# EAGLE design 240_ammeter (EAGLE 9.6.2)
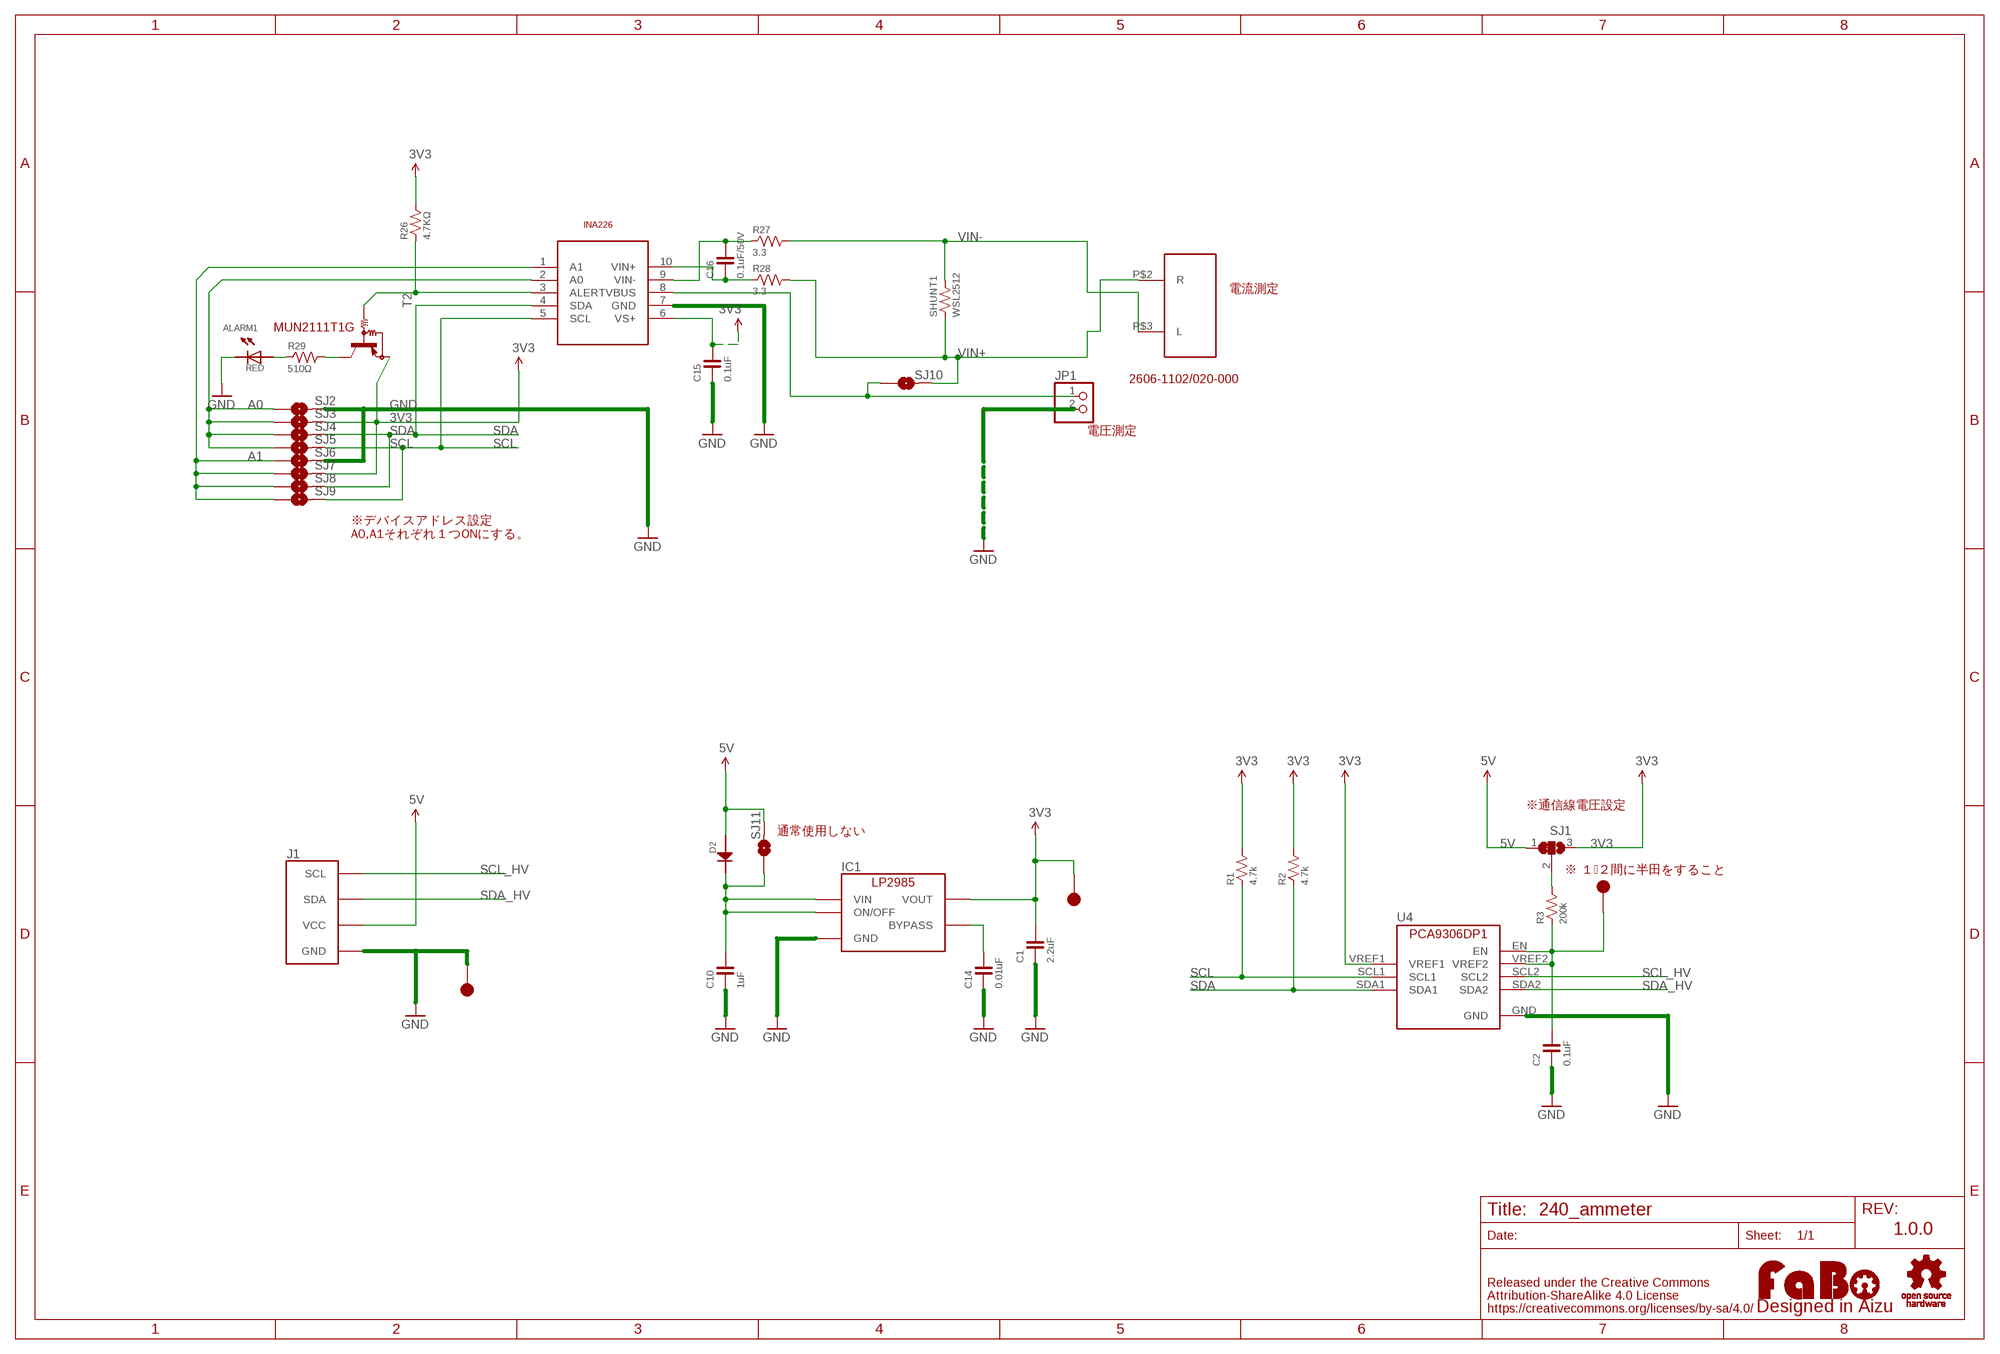
[diagram p0: schematic, sheet 1]

## Parts
ALARM1  RED  LED-0603  [0603]
C1  2.2uF  CAPACITOR-0603  [0603]
C2  0.1uF  CAPACITOR-0603  [0603]
C10  1uF  CAPACITOR-0603  [0603]
C14  0.01uF  CAPACITOR-0603  [0603]
C15  0.1uF  CAPACITOR-0603  [0603]
C16  0.1uF/50V  CAPACITOR-0603  [0603]
D2  1N4148  [1N4148W]
IC1  LP2985-33  LP2985-33DBV  [SOT-23-5]
J1  FABO_BRICK_I2C-S04B-PASK-2  [FABO_BRICK_I2C_S04B-PASK-2]
JP1  PINHD-1X2  [1X02]
LOGO1  LOGO_FABO-M  [LOGO_FABO_M]
R1  4.7k  RESISTOR-0603  [0603]
R2  4.7k  RESISTOR-0603  [0603]
R3  200k  RESISTOR-0603  [0603]
R26  4.7KΩ  RESISTOR-0603  [0603]
R27  3.3  RESISTOR-0603  [0603]
R28  3.3  RESISTOR-0603  [0603]
R29  510Ω  RESISTOR-0603  [0603]
SHUNT1  WSL2512  [2512INCH]
SJ1  SJ2W  [SJ_2]
SJ2  FABO-SMD-JUMPER-SELECT  [SMD-JUMPER_SELECT]
SJ3  FABO-SMD-JUMPER-SELECT  [SMD-JUMPER_SELECT]
SJ4  FABO-SMD-JUMPER-SELECT  [SMD-JUMPER_SELECT]
SJ5  FABO-SMD-JUMPER-SELECT  [SMD-JUMPER_SELECT]
SJ6  FABO-SMD-JUMPER-SELECT  [SMD-JUMPER_SELECT]
SJ7  FABO-SMD-JUMPER-SELECT  [SMD-JUMPER_SELECT]
SJ8  FABO-SMD-JUMPER-SELECT  [SMD-JUMPER_SELECT]
SJ9  FABO-SMD-JUMPER-SELECT  [SMD-JUMPER_SELECT]
SJ10  FABO-SMD-JUMPER-SELECT  [SMD-JUMPER_SELECT]
SJ11  FABO-SMD-JUMPER-SELECT  [SMD-JUMPER_SELECT]
T2  MUN2111T1-PNP_DRIVER-SC59-BEC  [SC59-BEC]
TP1  TP-15  [TP-15]
TP2  TP-15  [TP-15]
TP5  TP-15  [TP-15]
U3  TI-INA226  [TI-INA226]
U4  PCA9306DP1  [TSSOP8]
U$1  LOGO_OSHW-M_BOTTOM  [LOGO_OSHW_M_BOTTOM]
U$5  2606-1102/020-000  [2606-1102/020-000]

## Nets
3V3: C1.2 C15.2 IC1.5(VOUT) R1.2 R2.2 R26.2 SJ1.3 SJ3.2 SJ7.2 T2.E TP5.1 U3.6(VS+) U4.VREF1
5V: D2.ANODE J1.VCC SJ1.1 SJ11.2
A0: SJ2.1 SJ3.1 SJ4.1 SJ5.1 U3.2(A0)
A1: SJ6.1 SJ7.1 SJ8.1 SJ9.1 U3.1(A1)
GND: ALARM1.CATHODE C1.1 C2.1 C10.1 C14.1 C15.1 IC1.2(GND) J1.GND JP1.2 SJ2.2 SJ6.2 TP1.1 U3.7(GND) U4.GND
N$8: C2.2 R3.1 TP2.1 U4.EN U4.VREF2
N$9: R3.2 SJ1.2
N$11: C10.2 D2.CATHODE IC1.1(VIN) IC1.3(ON/OFF) SJ11.1
N$25: C16.2 R27.1 U3.9(VIN-)
N$26: C16.1 R28.1 U3.10(VIN+)
N$27: R26.1 T2.B U3.3(ALERT)
N$28: ALARM1.ANODE R29.1
N$29: R29.2 T2.C
N$30: C14.2 IC1.4(BYPASS)
N$32: JP1.1 SJ10.1 U3.8(VBUS)
SCL: R1.1 SJ5.2 SJ9.2 U3.5(SCL) U4.SCL1
SCL_HV: J1.SCL U4.SCL2
SDA: R2.1 SJ4.2 SJ8.2 U3.4(SDA) U4.SDA1
SDA_HV: J1.SDA U4.SDA2
VIN+: R28.2 SHUNT1.P$1 SJ10.2 U$5.P$2(R)
VIN-: R27.2 SHUNT1.P$2 U$5.P$3(L)

## Notes on the sheet
- 電流測定
- MUN2111T1G
- 2606-1102/020-000
- 電圧測定
- ※デバイスアドレス設定
  A0,A1それぞれ１つONにする。
- ※通信線電圧設定
- 通常使用しない
- ※ １−２間に半田をすること
- 1.0.0

## Library data of the parts
ALARM1 = FaBo-LED:LED
C1 C2 C10 C14-C16 = FaBo-Capacitor:CAPACITOR: CAPACITOR
D2 = FaBo-Diode:1N4148
IC1 = FaBo-Supply:LP2985: LP2985
J1 = FaBo-Template:FABO_BRICK_I2C: FaBo Brick I2C
JP1 = pinhead:PINHD-1X2: PIN HEADER
LOGO1 = component:LOGO_FABO
R1-R3 R26-R29 = FaBo-Resistors:RESISTOR: RESISTOR
SHUNT1 = FaBo-Resistors:WSL2512
SJ1 = jumper:SJ2W: SMD solder JUMPER
SJ2-SJ11 = FaBo-PIN:FABO-SMD-JUMPER-SELECT
T2 = transistor:*-PNP_DRIVER-: PNP Bias Resistor Transistor
TP1 TP2 TP5 = FaBo-Supply:TP
U3 = FaBo-Sensor:TI-INA226
U4 = FaBo-LevelTranslator:PCA9306DP1
U$1 = component:LOGO_OSHW
U$5 = FaBo-Terminal:2606-1102/020-000

## Board
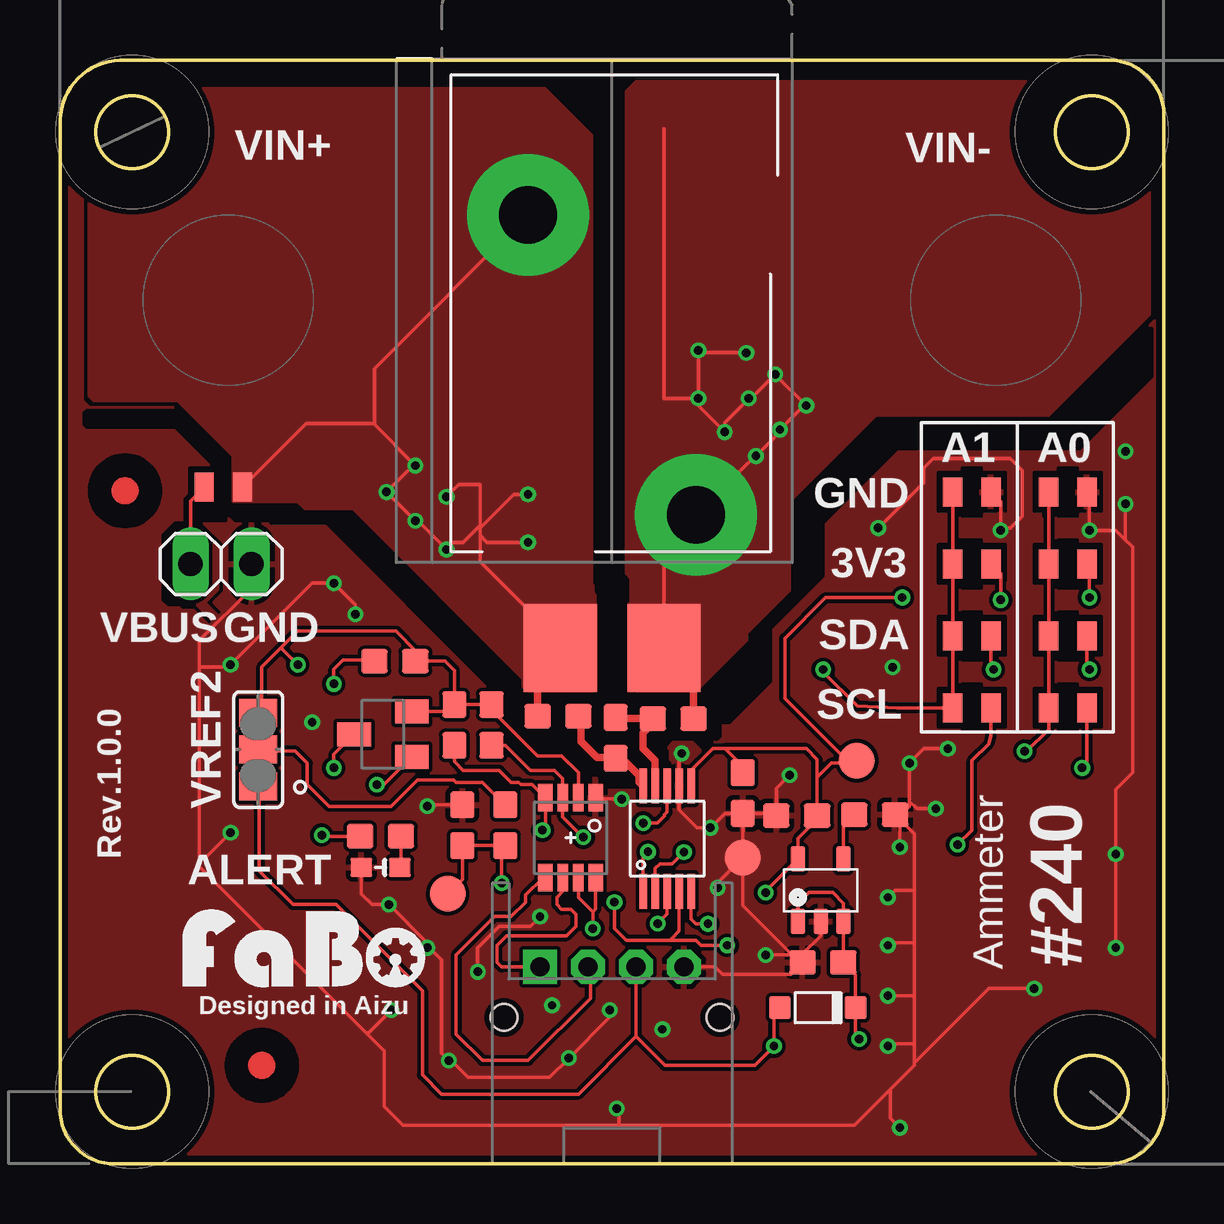
[diagram p1: board, top side]
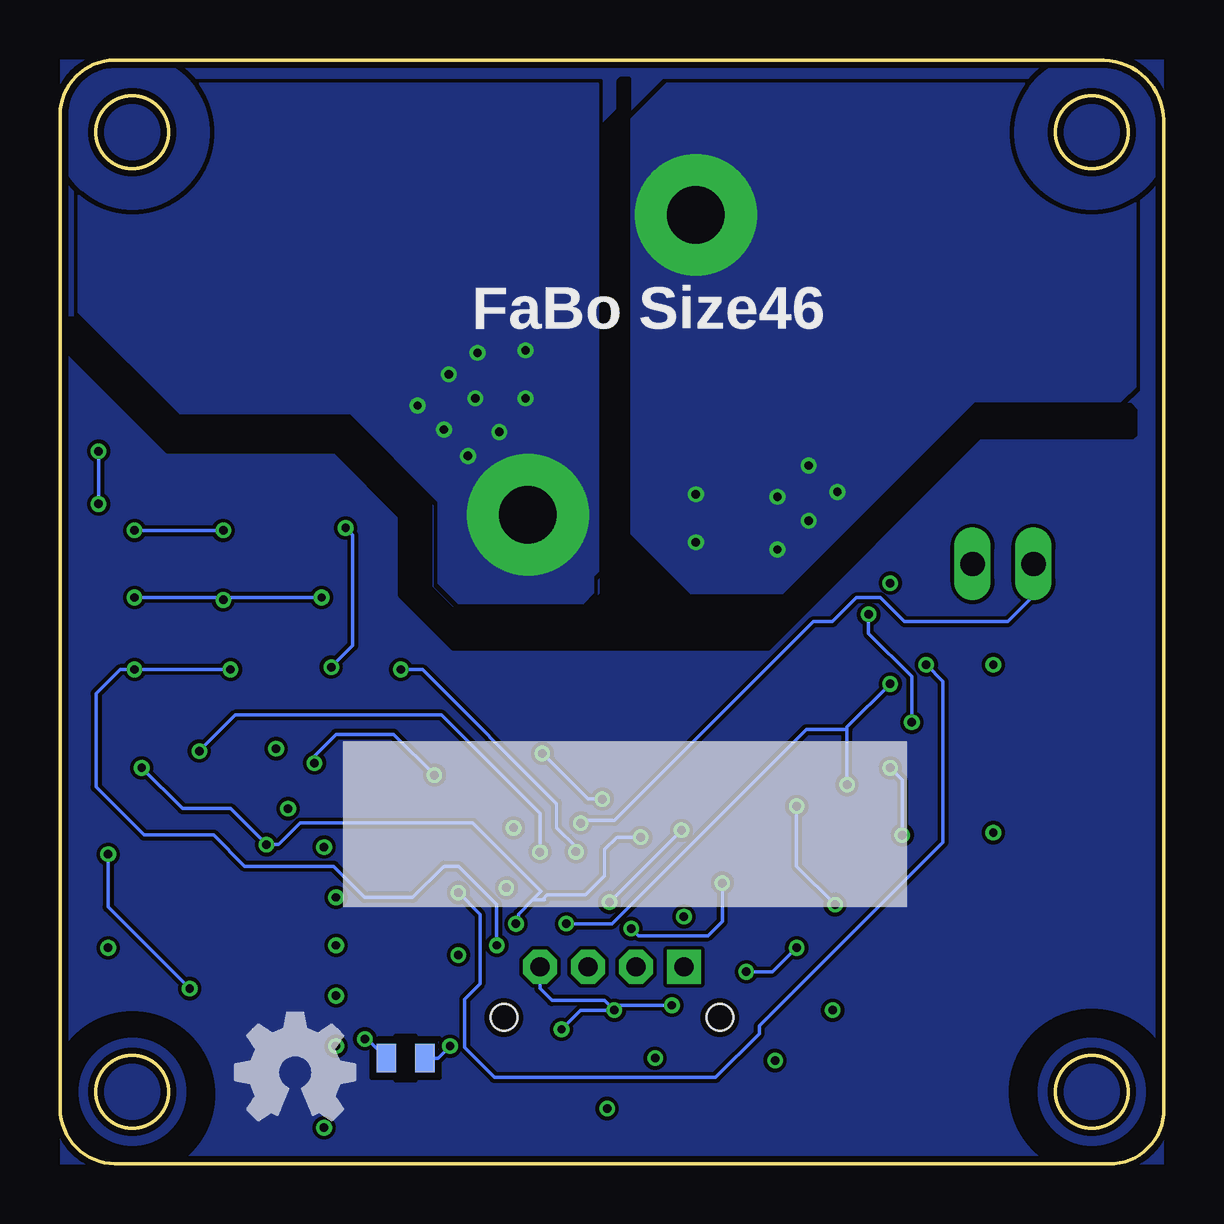
[diagram p2: board, bottom side, seen from below]

Size 46.02 x 46.02 mm. Coordinates in mm from the lower left corner, seen from the top.
Outline: 0.01,2.51 0.01,43.51 arc-87 2.51,46.01 43.51,46.01 arc-100 46.01,43.51 46.01,2.51 arc-99 43.51,0.01 2.51,0.01 arc-102 0.01,2.51
Outline: circle at 3.01,3.01 radius 1.5
Outline: circle at 43.01,3.01 radius 1.5
Outline: circle at 43.01,43.01 radius 1.5
Outline: circle at 3.01,43.01 radius 1.5
Copper layers (1*16): Top 0.035mm / dielectric 1.6mm / Bottom 0.035mm
Design rules "PCBway": minimum track width 6mil, minimum drill 12mil, track to track 6mil, track to pad 6mil, pad to pad 6mil, via to via 6mil, smd to smd 6mil, copper to edge 10mil, drill to drill 10mil, minimum pad ring 10mil, minimum via ring 6mil, stop-mask expansion 2mil, vias tented up to drill 100mil, thermal gap 8mil
tRestrict: area 1,19.8 to 19,31.4; area 5.7,26.8 to 6.9,27.4; area 27.2,18.4 to 45.5,34.8; area 22.3,19.4 to 23.5,45.4; area -0.3,39.7 to 6.4,46.4; area 39.7,39.7 to 46.4,46.4; area -0.3,-0.3 to 6.4,6.4; area 39.7,-0.3 to 46.4,6.4; area 37.7,27.1 to 38.3,28.9; area 41.7,27.1 to 42.3,28.9; area 37.7,24.1 to 38.3,25.9; area 41.7,24.1 to 42.3,25.9; 4 more areas; 199 lines
bRestrict: area 1.2,21.5 to 45.9,45.2; area -0.3,39.7 to 6.4,46.4; area 39.7,39.7 to 46.4,46.4; area 39.7,-0.4 to 46.4,6.3; area -0.3,-0.3 to 6.4,6.4; area 0.2,0.2 to 5.8,5.8; area 40.2,0.2 to 45.8,5.8; area 31.3,3.6 to 31.9,5.2; 12 lines

### Footprints (pad centres in the part's own frame; a part is rotated, then mirrored left to right if it is on the bottom)
0603 = smd 0.9 x 0.8: ANODE -0.8,0; CATHODE 0.8,0
0603' = smd 1.1 x 1: 1 -0.85,0; 2 0.85,0
1N4148W = smd 0.9 x 0.95: ANODE 0,0; CATHODE 3.15,0
SOT-23-5 = smd 0.6 x 1.05: 1 -0.95,-1.3; 2 0,-1.3; 3 0.95,-1.3; 4 0.95,1.3; 5 -0.95,1.3
FABO_BRICK_I2C_S04B-PASK-2 = drill 0.8 pad 1.422 octagon: GND -3,0; SDA 1,0; VCC -1,0 | drill 0.8 pad 1.422 square: SCL 3,0 | hole 1.1: 4.5,2.1; -4.5,2.1
1X02 = drill 1.016 long: 1 -1.27,0; 2 1.27,0
2512INCH = smd 3.05 x 3.68: P$1 -2.16,0; P$2 2.16,0
SJ_2 = smd 1.168 x 1.6: 1 -1.524,0; 2 0,0; 3 1.524,0
SMD-JUMPER_SELECT = smd 0.8 x 1.2: 1 -0.8,0; 2 0.8,0
SC59-BEC = smd 1 x 1.4: B -0.95,-1.2; C 0,1.2; E 0.95,-1.2
TP-15 = smd 1.5 x 1.5: 1 0,0
TI-INA226 = smd 1.45 x 0.3: 1 -2.2,1; 2 -2.2,0.5; 3 -2.2,0; 4 -2.2,-0.5; 5 -2.2,-1; 6 2.2,-1; 7 2.2,-0.5; 8 2.2,0; 9 2.2,0.5; 10 2.2,1
TSSOP8 = smd 0.6 x 1.15: EN -1.05,1.663; GND -1.05,-1.663; SDA1 1.05,-1.663; SDA2 1.05,1.663 | smd 0.45 x 1.15: SCL1 0.325,-1.663; SCL2 0.325,1.663; VREF1 -0.325,-1.663; VREF2 -0.325,1.663
2606-1102/020-000 = drill 2.4 pad 5.08: P$2 3.5,-6.25; P$3 -3.5,6.25

### Placement (x,y rotation side)
ALARM1  13.36,12.36 180 top
C1  2.2uF  [0603']  30.71,14.52 0 top
C2  0.1uF  [0603']  16.77,14.12 270 top
C10  1uF  [0603']  31.8,8.4 0 top
C14  0.01uF  [0603']  33.96,14.56 180 top
C15  0.1uF  [0603']  28.46,15.46 90 top
C16  0.1uF/50V  [0603']  23.16,17.76 90 top
D2  30.01,6.51 0 top
IC1  31.71,11.41 0 top
J1  23.01,8.21 180 top
JP1  6.71,25.01 0 top
LOGO1  10.17,7 0 top
R1  4.7k  [0603']  17.99,18.3 90 top
R2  4.7k  [0603']  16.44,18.3 90 top
R3  200k  [0603']  18.56,14.12 90 top
R26  4.7KΩ  [0603']  13.96,20.96 0 top
R27  3.3  [0603']  25.56,18.56 0 top
R28  3.3  [0603']  20.76,18.66 180 top
R29  510Ω  [0603']  13.36,13.66 180 top
SHUNT1  23.01,21.51 0 top
SJ1  8.26,17.27 90 top
SJ2  42.01,28.01 0 top
SJ3  42.01,25.01 0 top
SJ4  42.01,22.01 0 top
SJ5  42.01,19.01 0 top
SJ6  38.01,28.01 0 top
SJ7  38.01,25.01 0 top
SJ8  38.01,22.01 0 top
SJ9  38.01,19.01 0 top
SJ10  6.81,28.21 0 top
SJ11  31.61,4.41 0 bottom
T2  13.46,17.91 90 top
TP1  28.46,12.76 0 top
TP2  16.16,11.26 0 top
TP5  33.21,16.81 0 top
U3  25.31,13.56 90 top
U4  21.28,13.6 180 top
U$1  36.21,3.82 0 top
U$3  [MARK_POINT_3MM]  8.41,4.11 0 top
U$4  [MARK_POINT_3MM]  2.71,28.06 0 top
U$5  23.01,33.31 180 top

### Tracks (layer width: path | path; a pad name or v marks a point on that pad's centre or on a via)
3V3  (via drill 0.35)
  Top 0.152: U3.6 26.31,16.41 27.21,17.31 27.71,17.31 | C15.2 28.46,16.56 27.71,17.31 | 31.56,16.11 C1.2 31.56,14.36 30.76,13.56 IC1.5 | 31.56,16.11 31.56,16.86 31.11,17.31 27.71,17.31 | IC1.5 30.76,13.06 | R2.2 R1.2 17.99,18.93 19.91,17.01 20.91,17.01 21.61,16.32 U4.VREF1 | R2.2 16.44,20.58 16.06,20.96 R26.2 14.81,21.41 14.01,22.21 9.91,22.21 9.26,21.56 | T2.E 16.15,18.86 R2.2 | SJ1.3 8.41,18.95 8.41,20.71 9.26,21.56 | 31.56,16.11 32.16,16.71 33.11,16.71 TP5.1 32.81,16.81 30.21,19.41 30.21,21.91 31.91,23.61 v35.11,23.61 | IC1.5 29.41,11.36 v29.41,11.31 | v9.91,20.81 9.26,21.46 9.26,21.56 | v39.21,23.51 39.21,24.61 SJ7.2 | SJ3.2 42.91,24.91 v42.91,23.61
  Bottom 0.152: v29.41,11.31 28.51,10.41 28.51,7.51 29.15,6.87 29.15,4.85 27.91,3.61 18.69,3.61 16.87,5.43 16.87,5.75 9.21,13.41 9.21,20.11 v9.91,20.81 | v35.11,23.61 39.11,23.61 v39.21,23.51 39.31,23.61 v42.91,23.61
5V  (via drill 0.35)
  Top 0.152: J1.VCC 24.01,5.31 | 24.01,5.31 25.21,4.11 28.96,4.11 v29.76,4.91 29.76,6.26 D2.ANODE | SJ1.1 8.31,15.7 8.31,12.21 9.71,10.81 11.51,10.81 15.11,7.21 15.11,3.71 15.91,2.91 21.61,2.91 24.01,5.31
  Bottom 0.152: SJ11.2 30.26,4.41 v29.76,4.91
A0  (via drill 0.35)
  Top 0.152: 24.81,11.8 U3.2 24.81,12.31 25.01,12.51 25.52,12.51 v26.01,13 | 41.26,27.61 SJ2.1 SJ3.1 SJ4.1 | 41.26,21.86 SJ4.1 | SJ4.1 SJ5.1 41.21,18.11 40.31,17.21 v40.21,17.21
  Bottom 0.152: v26.01,13 26.01,14.61 30.11,18.71 38.71,18.71 v40.21,17.21
A1  (via drill 0.35)
  Top 0.152: U3.1 24.31,12.81 v24.51,13.01 | v31.81,20.61 31.81,20.51 33.24,19.08 34.91,19.01 SJ9.1 SJ8.1 SJ7.1 SJ6.1
  Bottom 0.152: v24.51,13.01 24.51,13.21 25.31,14.01 25.31,15.01 30.91,20.61 v31.81,20.61
GND  (via drill 0.35)
  Top 0.152: IC1.2 31.71,9.51 30.95,8.75 C10.1 | C10.1 30.89,8.34 | 28.61,14.61 C15.1 27.71,14.61 v27.11,14.01 26.56,14.01 25.81,14.76 U3.7 25.81,17.01 v25.91,17.11 | 28.61,14.61 29.77,14.61 C1.1 29.86,15.66 v30.41,16.21 | C2.1 15.37,14.97 v15.31,14.91 | v23.41,15.21 22.38,15.21 U4.GND | TP1.1 28.46,14.46 28.61,14.61 | JP1.2 7.98,23.98 5.81,21.81 5.81,20.71 | 5.81,20.71 5.81,12.81 | 5.81,12.81 5.81,12.41 12.76,5.46 | 34.61,3.11 33.11,1.61 23.31,1.61 | 34.61,3.11 35.61,4.11 35.61,4.21 | 35.61,7.01 35.61,5.01 | 35.61,4.21 35.61,5.01 | 35.61,7.01 35.61,9.21 | 35.61,9.21 35.61,11.41 | 35.61,11.41 35.61,13.76 35.01,14.36 | 34.94,14.44 C14.1 | 12.76,5.46 13.51,4.71 13.51,2.41 14.31,1.61 23.31,1.61 | 35.41,15.11 v35.41,16.71 36.01,17.31 v37.01,17.31 | 35.41,15.11 35.41,14.91 34.94,14.44 | v40.61,7.31 38.71,7.31 35.61,4.21 | ALARM1.CATHODE 12.56,11.26 13.01,10.81 v13.71,10.81 15.31,9.21 15.31,9.11 | SJ6.2 39.21,27.61 39.21,26.51 | 39.21,26.51 v39.21,26.41 | SJ2.2 42.91,27.91 v42.91,26.41 44.01,26.41 44.41,26.01 | v36.51,14.81 35.71,14.81 35.41,15.11 | v35.01,13.21 35.01,14.36 | 35.01,14.36 34.94,14.44 | v34.51,11.11 34.81,11.41 35.61,11.41 | v34.51,9.11 34.61,9.21 35.61,9.21 | v34.51,7.01 35.61,7.01 | v34.51,4.91 34.61,5.01 35.61,5.01 | J1.GND 27.31,8.21 27.61,7.91 30.46,7.91 30.89,8.34 | v27.41,11.51 27.41,11.71 TP1.1 | TP1.1 28.46,10.76 30.89,8.34 | v17.41,8.01 17.41,9.01 18.31,9.91 19.61,9.91 v20.01,10.31 | 15.31,9.11 v15.31,9.01 | 15.31,9.11 15.91,8.51 15.91,4.61 v16.21,4.31 16.31,4.31 17.01,3.61 20.41,3.61 v21.21,4.41 22.91,6.11 v22.91,6.41 | v35.01,1.51 34.61,1.91 34.61,3.11 | v12.31,22.91 12.31,23.31 v11.41,24.21 10.51,24.21 v7.11,20.81 7.01,20.71 5.81,20.71
  Top 0.152: v7.11,13.81 6.11,12.81 5.81,12.81 | v13.81,6.41 12.86,5.46 12.76,5.46 | v23.21,2.31 23.31,2.21 23.31,1.61 | v29.41,8.71 30.65,8.71 C10.1 | v44.01,9.01 v44.01,12.91 44.01,15.61 44.71,16.31 44.71,25.71 44.61,25.81 44.41,26.01 | v34.11,26.51 36.01,28.41 36.01,29.01 36.41,29.41 39.61,29.41 40.11,28.91 40.11,27.01 39.61,26.51 39.21,26.51 | v44.41,27.51 44.41,26.01
  Bottom 0.152: v15.31,14.91 15.31,12.41 v13.71,10.81 | v25.91,17.11 24.01,15.21 v23.41,15.21 | v30.41,16.21 32.11,17.91 34.51,17.91 35.41,17.01 v35.41,16.71 | v42.91,26.41 v39.21,26.41 | v44.01,12.91 44.01,10.71 v40.61,7.31 | v22.91,6.41 23.31,6.81 25.51,6.81 26.01,7.31 J1.GND | v20.51,6.61 22.71,6.61 v22.91,6.41 | v17.41,8.01 16.31,8.01 v15.31,9.01 | v10.51,18.41 10.51,20.31 12.31,22.11 v12.31,22.91 | v22.91,6.41 24.31,6.41 v25.11,5.61 | v34.11,26.51 33.81,26.21 33.81,21.61 v34.71,20.71 | v44.41,29.71 v44.41,27.51
  pour Top (rank 6): -1.39,-1.29 -1.39,46.81 47.11,46.81 47.11,-1.29
GND1
  pour Bottom (isolate 0.04, rank 6): 0.01,46.01 46.01,46.01 46.01,0.01 0.01,0.01
N$8  (via drill 0.35)
  Top 0.152: TP2.1 16.77,11.87 C2.2 R3.1 18.41,13.12 v18.41,11.71 | U4.VREF2 21.61,11.12 22.21,10.51 | 22.21,10.51 v22.21,9.81 | U4.EN 22.33,10.63 22.21,10.51
  Bottom 0.152: v22.21,9.81 21.91,9.51 19.01,9.51 18.41,10.11 v18.41,11.71
N$9
  Top 0.152: SJ1.2 8.32,17.21 9.81,17.21 10.31,16.71 10.31,15.81 11.21,14.91 13.81,14.91 14.91,16.01 16.41,16.01 16.51,15.91 17.62,15.91 R3.2
N$11  (via drill 0.35)
  Top 0.152: 33.11,6.56 D2.CATHODE | D2.CATHODE 33.16,7.89 C10.2 IC1.3 32.66,10.86 32.21,11.31 31.21,11.31 30.76,10.86 IC1.1 | v33.31,5.21 33.16,5.36 D2.CATHODE
  Bottom 0.152: SJ11.1 33.21,5.21 v33.31,5.21
N$25
  Top 0.254: 24.81,18.46 R27.1
  Top 0.305: C16.2 23.21,18.56 R27.1 | 24.81,18.46 24.31,17.96 24.31,17.31 24.81,16.81 U3.9
N$26
  Top 0.152: C16.1 23.14,16.94 23.31,17.11
  Top 0.305: R28.1 21.71,18.56 21.71,17.61 22.39,16.94 23.14,16.94 | U3.10 24.14,15.93 24.14,16.21 23.31,17.03 23.31,17.11
N$27  (via drill 0.35)
  Top 0.152: T2.B 13.51,15.81 v13.21,15.81 | v11.41,20.01 11.41,20.61 11.81,21.01 13.06,21.01 R26.1 | U3.3 25.31,10.42 v24.91,10.02
  Bottom 0.152: v13.21,15.81 13.21,18.11 | 13.21,18.11 13.21,18.21 v11.41,20.01 | v24.91,10.02 23,10.02 14.91,18.11 13.21,18.11
N$28
  Top 0.152: R29.1 14.21,12.41 ALARM1.ANODE
N$29  (via drill 0.35)
  Top 0.152: T2.C 11.41,17.06 v11.41,16.51 | v10.91,13.71 10.96,13.66 R29.2
  Bottom 0.152: v11.41,16.51 10.91,16.01 v10.91,13.71
N$30
  Top 0.152: IC1.4 32.66,14.11 C14.2
N$32  (via drill 0.35)
  Top 0.152: v24.31,14.21 24.91,14.21 25.2,14.5 25.2,14.56 25.31,14.67 U3.8 | JP1.1 5.44,27.64 SJ10.1
  Bottom 0.152: v24.31,14.21 24.21,14.31 22.91,14.31 14.61,22.61 13.81,22.61 12.81,23.61 11.81,23.61 10.81,22.61 6.51,22.61 5.44,23.68 JP1.1
SCL  (via drill 0.35)
  Top 0.152: 18.29,17.15 R1.1 18.57,17.45 19.61,16.41 20.61,16.41 20.96,16.07 U4.SCL1 20.96,14.47 v21.81,13.62 | U3.5 26.31,10.21 26.51,10.01 v27.01,10.01 | v37.41,13.31 38.01,13.91 38.01,16.81 38.71,17.51 38.81,17.86 SJ9.2 | SJ5.2 42.81,16.71 v42.61,16.51
  Bottom 0.152: v27.01,10.01 26.91,10.01 26.91,10.41 26.31,11.01 | 26.31,11.01 25.96,11.36 28.81,14.21 36.01,14.21 36.91,13.31 v37.41,13.31 38.91,14.81 40.91,14.81 v42.61,16.51 | 26.31,11.01 25.91,11.01 | 25.91,11.01 25.81,11.01 | 25.91,11.01 25.71,11.21 24.11,11.21 23.31,12.01 23.31,13.11 22.8,13.62 v21.81,13.62
SCL_HV
  Top 0.152: J1.SCL 18.41,8.21 18.21,8.41 18.21,9.11 18.61,9.51 21.11,9.51 21.51,9.91 21.51,10.41 21.31,10.61 20.91,10.61 20.71,10.81 20.71,11.11 20.96,11.36 U4.SCL2
SDA  (via drill 0.35)
  Top 0.152: 20.21,15.24 U4.SDA1 | 16.44,16.95 R2.1 16.44,16.78 16.81,16.41 18.31,16.41 18.81,15.91 19.11,15.91 19.21,15.81 19.68,15.81 U4.SDA1 | U3.4 25.81,9.71 25.51,9.41 25.41,9.31 | 25.41,9.31 23.61,9.31 23.11,9.81 v23.11,10.91 | v27.81,9.11 26.71,9.11 26.51,9.31 25.41,9.31 | U4.SDA1 20.23,14.03 v20.11,13.91 | SJ8.2 38.81,20.71 v38.91,20.61 | v42.91,20.61 42.81,20.71 SJ4.2
  Bottom 0.152: v27.81,9.11 27.81,10.81 29.41,12.41 30.01,12.41 31.31,11.11 33.31,11.11 34.61,12.41 38.31,12.41 39.61,13.71 42.51,13.71 44.51,15.71 44.51,19.61 43.51,20.61 v42.91,20.61 v38.91,20.61 | v20.11,13.91 v23.11,10.91
SDA_HV
  Top 0.152: J1.SDA 22.11,8.11 22.11,6.91 19.51,4.31 17.61,4.31 16.51,5.41 16.51,8.71 18.11,10.31 18.81,10.31 19.41,10.91 19.41,11.21 20.13,11.93 U4.SDA2
VIN+  (via drill 0.35)
  Top 0.152: 17.51,26.61 17.51,28.31 16.61,28.31 v16.11,27.81 | 17.51,26.61 17.51,26.51 | 17.51,26.51 17.51,26.21 | 17.51,26.21 17.51,25.11 20.85,21.77 20.85,21.71 SHUNT1.P$1 | SJ10.2 10.26,30.86 13.06,30.86 13.11,30.81 | 17.51,26.51 18.91,27.91 v19.51,27.91 | 17.51,26.61 16.81,25.91 16.41,25.91 v16.11,25.61 14.91,26.81 v14.81,26.81 v13.61,28.01 14.71,29.11 v14.81,29.11 13.11,30.81 | v19.51,25.91 17.81,25.91 17.51,26.21 | U$5.P$2 13.11,33.16 13.11,30.81
  Top 0.254: 21.61,20.75 SHUNT1.P$1 19.91,20.57
  Top 0.305: R28.2 19.91,20.77 20.85,21.71
  pour Top (rank 2, no thermals): 1.21,32.01 1.21,44.51 1.51,44.81 20.21,44.81 22.21,42.81 22.21,23.81 22.31,23.71 22.31,19.81 22.21,19.71 19.51,19.71 19.31,19.91 19.31,20.21 12.21,27.31 10.21,27.31 9.91,27.61 7.21,27.61 7.21,29.51 4.91,31.81 1.41,31.81
  pour Bottom (no thermals): 1.71,45.01 20.71,45.01 22.21,43.51 22.21,26.31 19.71,23.81 15.91,23.81 7.91,31.81 1.81,31.81 1.21,32.41 1.21,44.51
VIN-  (via drill 0.35)
  Top 0.152: 25.17,21.81 SHUNT1.P$2 25.17,25.72 U$5.P$3 28.96,29.51 v29.01,29.51 30.01,30.51 v30.01,30.61 31.01,31.61 v31.11,31.61 v29.81,32.91 28.81,31.91 v28.71,31.91 27.71,30.91 v27.71,30.51 26.61,31.61 v26.61,31.91 | 25.17,43.15 25.17,31.91 v26.61,31.91 | v26.61,31.91 v26.61,33.91 26.71,33.81 v28.61,33.81
  Top 0.254: SHUNT1.P$2 26.41,20.27
  Top 0.305: R27.2 26.41,20.57 25.17,21.81
  pour Top (no thermals): 23.71,23.31 23.71,20.01 24.01,19.71 26.51,19.71 28.61,21.81 28.61,22.11 30.41,23.91 30.41,27.61 34.01,31.21 41.21,31.21 45.41,35.41 45.41,44.31 44.61,45.11 24.01,45.11 23.61,44.71 23.61,24.61 23.81,24.41 23.81,23.41
  pour Bottom (no thermals): 23.61,45.01 44.51,45.01 45.21,44.31 45.21,35.51 41.01,31.31 33.91,31.31 30.21,27.61 30.21,24.21 29.41,23.41 24.21,23.41 23.81,23.81 23.81,24.51 23.61,24.71

### Text on the board
tPlace: VIN+ | VIN- | A1 | A0 | GND | 3V3 | VBUS | GND | SDA | SCL | VREF2 | Rev.1.0.0 | ALERT | Ammeter | #240 | Designed in Aizu
bPlace: FaBo Size46
tDocu: FaBo Brick New Size Type 46 / 寸法図 | R-2.5